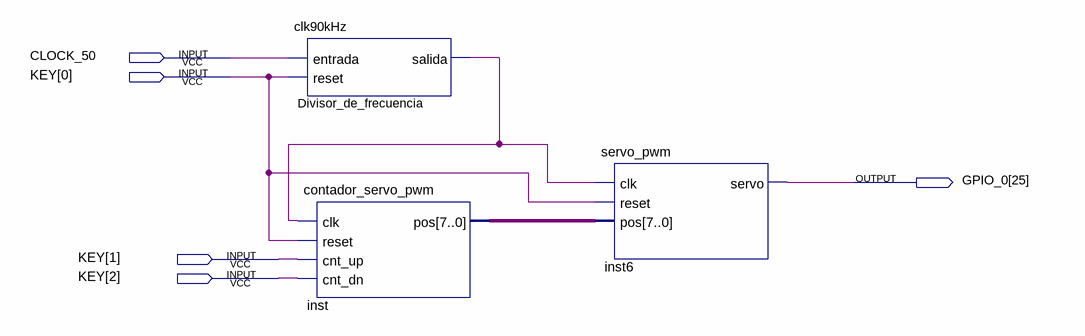
[diagram p0: schematic sheet]
// Quartus schematic Servo-test2.bdf as structural Verilog: 3 symbols, 5 pins
module \Servo-test2  (
  input  CLOCK_50,
  input  [2:0] KEY,
  output [25:25] GPIO_0
);

  wire Divisor_de_frecuencia_salida;
  wire [7:0] inst_pos;

  clk90kHz Divisor_de_frecuencia (.entrada(CLOCK_50), .reset(KEY[0]), .salida(Divisor_de_frecuencia_salida));
  contador_servo_pwm inst (
    .clk(Divisor_de_frecuencia_salida), .reset(KEY[0]), .cnt_up(KEY[1]), .cnt_dn(KEY[2]), .pos(inst_pos));
  servo_pwm inst6 (.clk(Divisor_de_frecuencia_salida), .reset(KEY[0]), .pos(inst_pos), .servo(GPIO_0[25]));
endmodule
